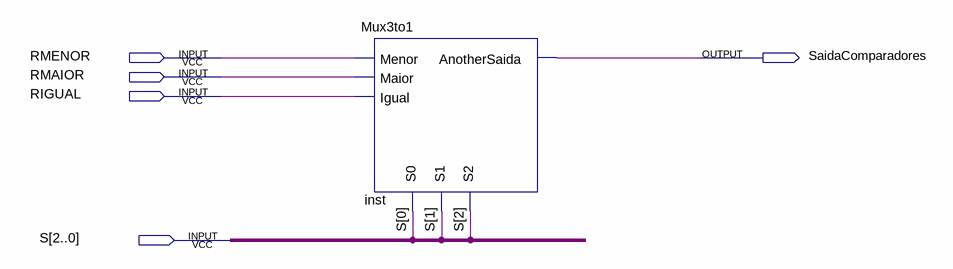
[diagram p0: schematic sheet]
// Quartus schematic MuxComparadores.bdf as structural Verilog: 1 symbols, 5 pins
module MuxComparadores (
  input  RMENOR,
  input  RMAIOR,
  input  RIGUAL,
  input  [2:0] S,
  output SaidaComparadores
);

  Mux3to1 inst (
    .Menor(RMENOR), .Maior(RMAIOR), .Igual(RIGUAL), .S0(S[0]), .S1(S[1]), .S2(S[2]),
    .AnotherSaida(SaidaComparadores));
endmodule
